# EasyEDA Pro project Pannel.eprj

# Schematic SCH

## Sheets
1 PWR: Board Name: Board1; Create Date: 2025-08-30; Page Name: PWR; Project Name: Pannel; Schematic Name: SCH; Update Date: 2025-08-30; Company: 嘉立创EDA; Page Size: A4; Version: V1.0
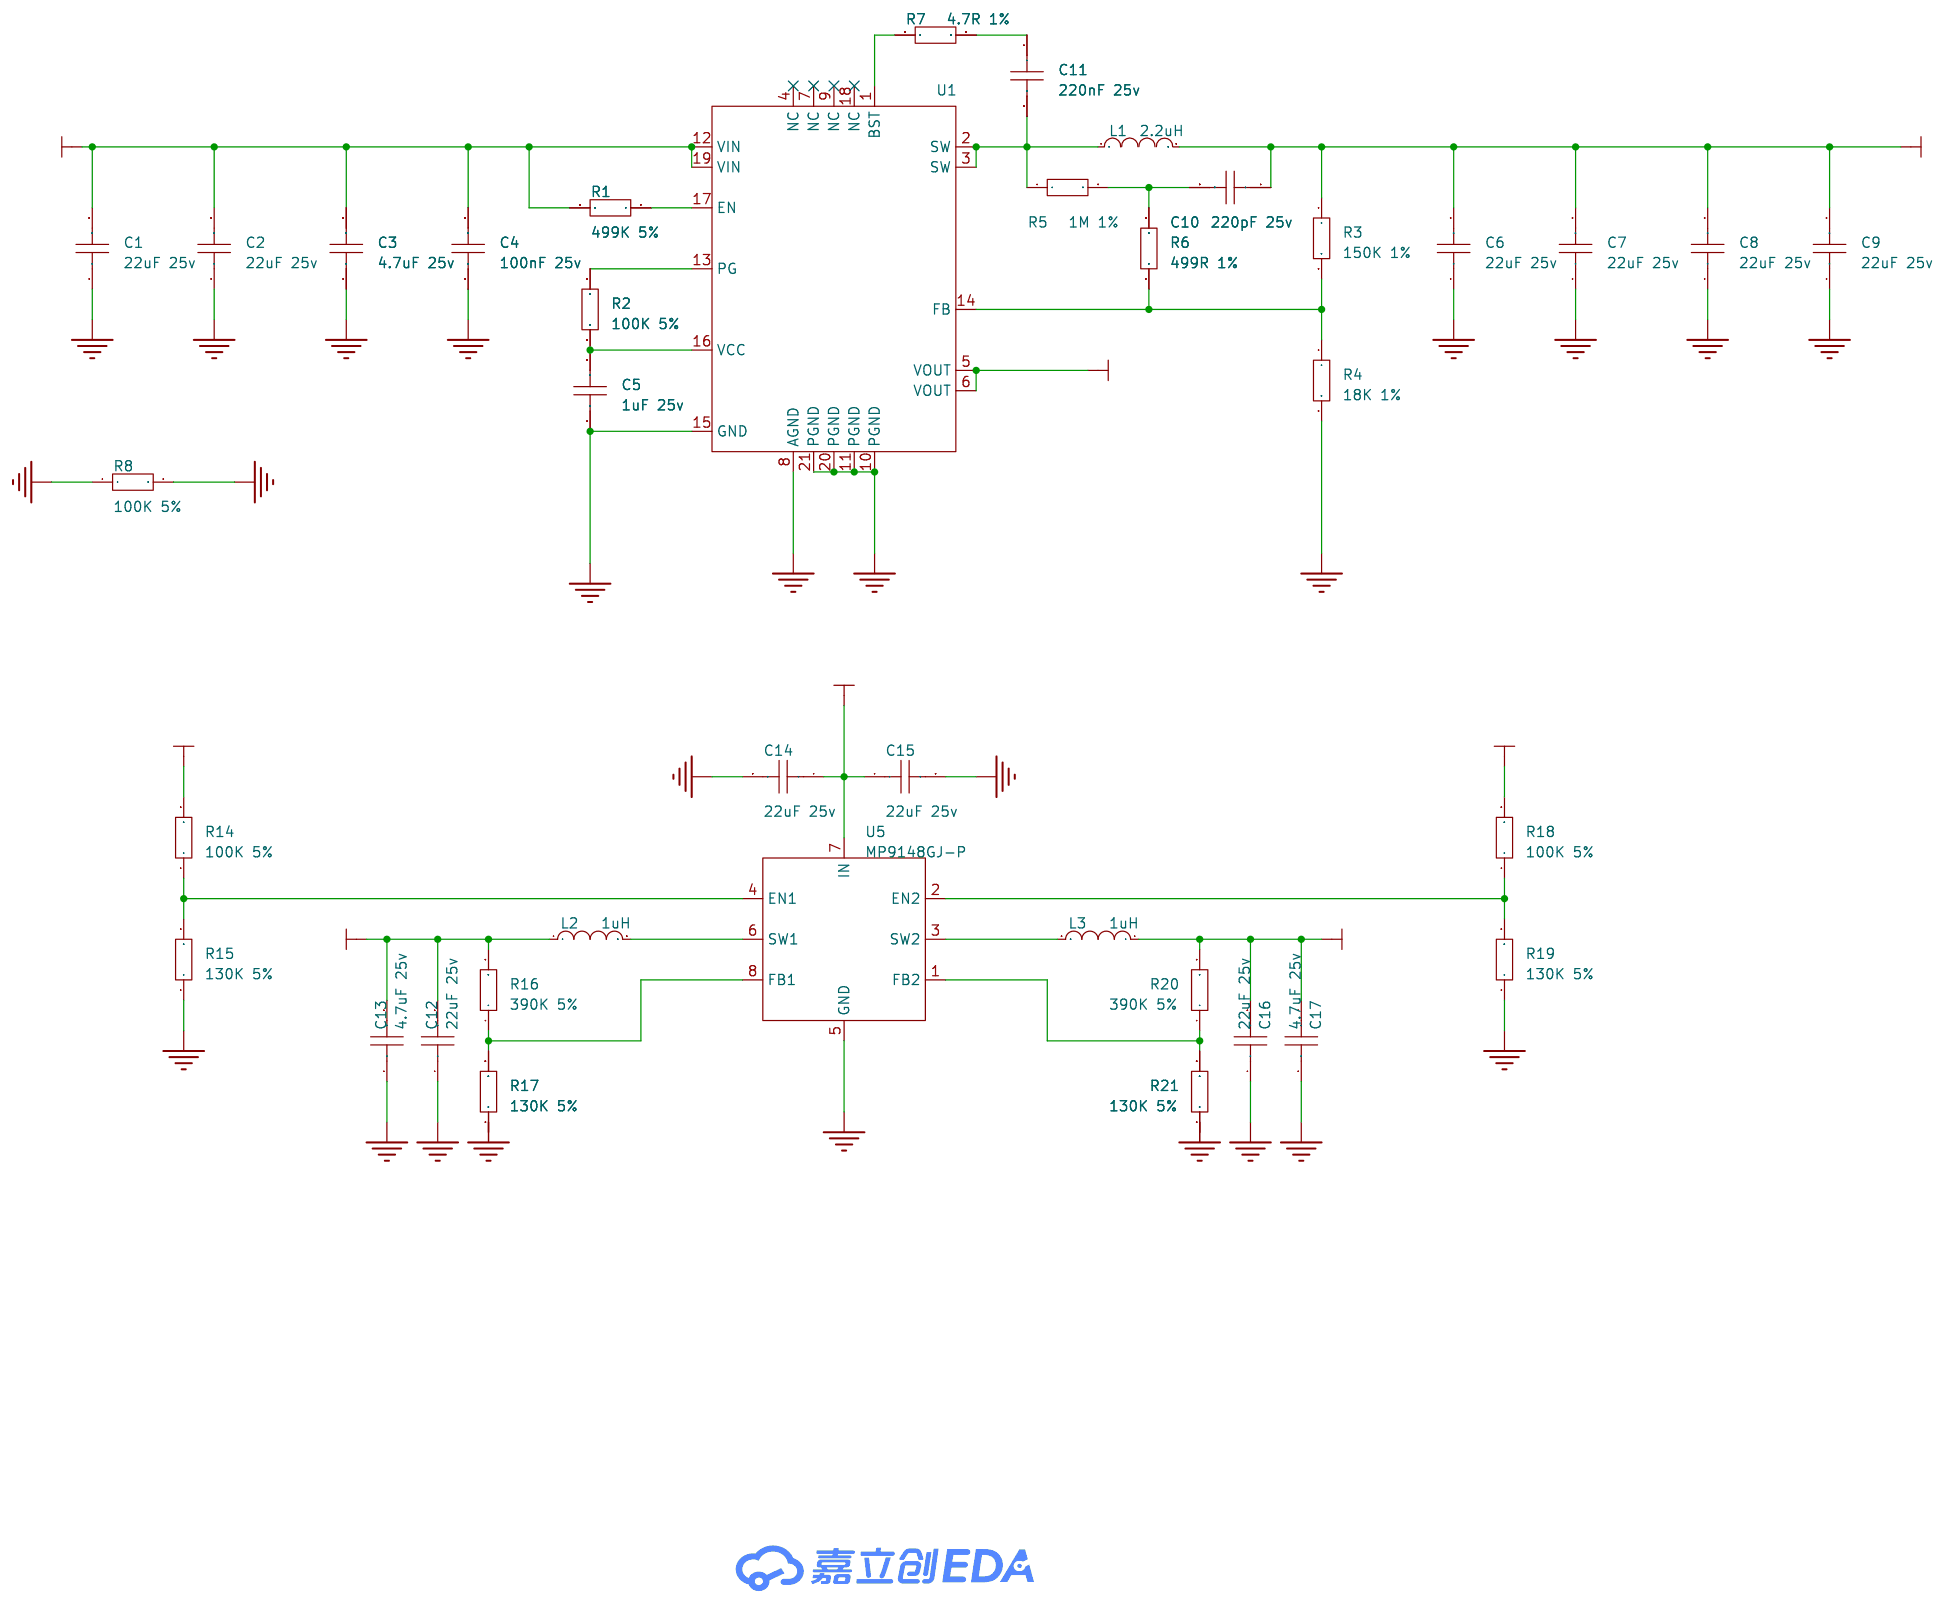
[diagram p0: PWR]
2 Connector: Page Name: Connector
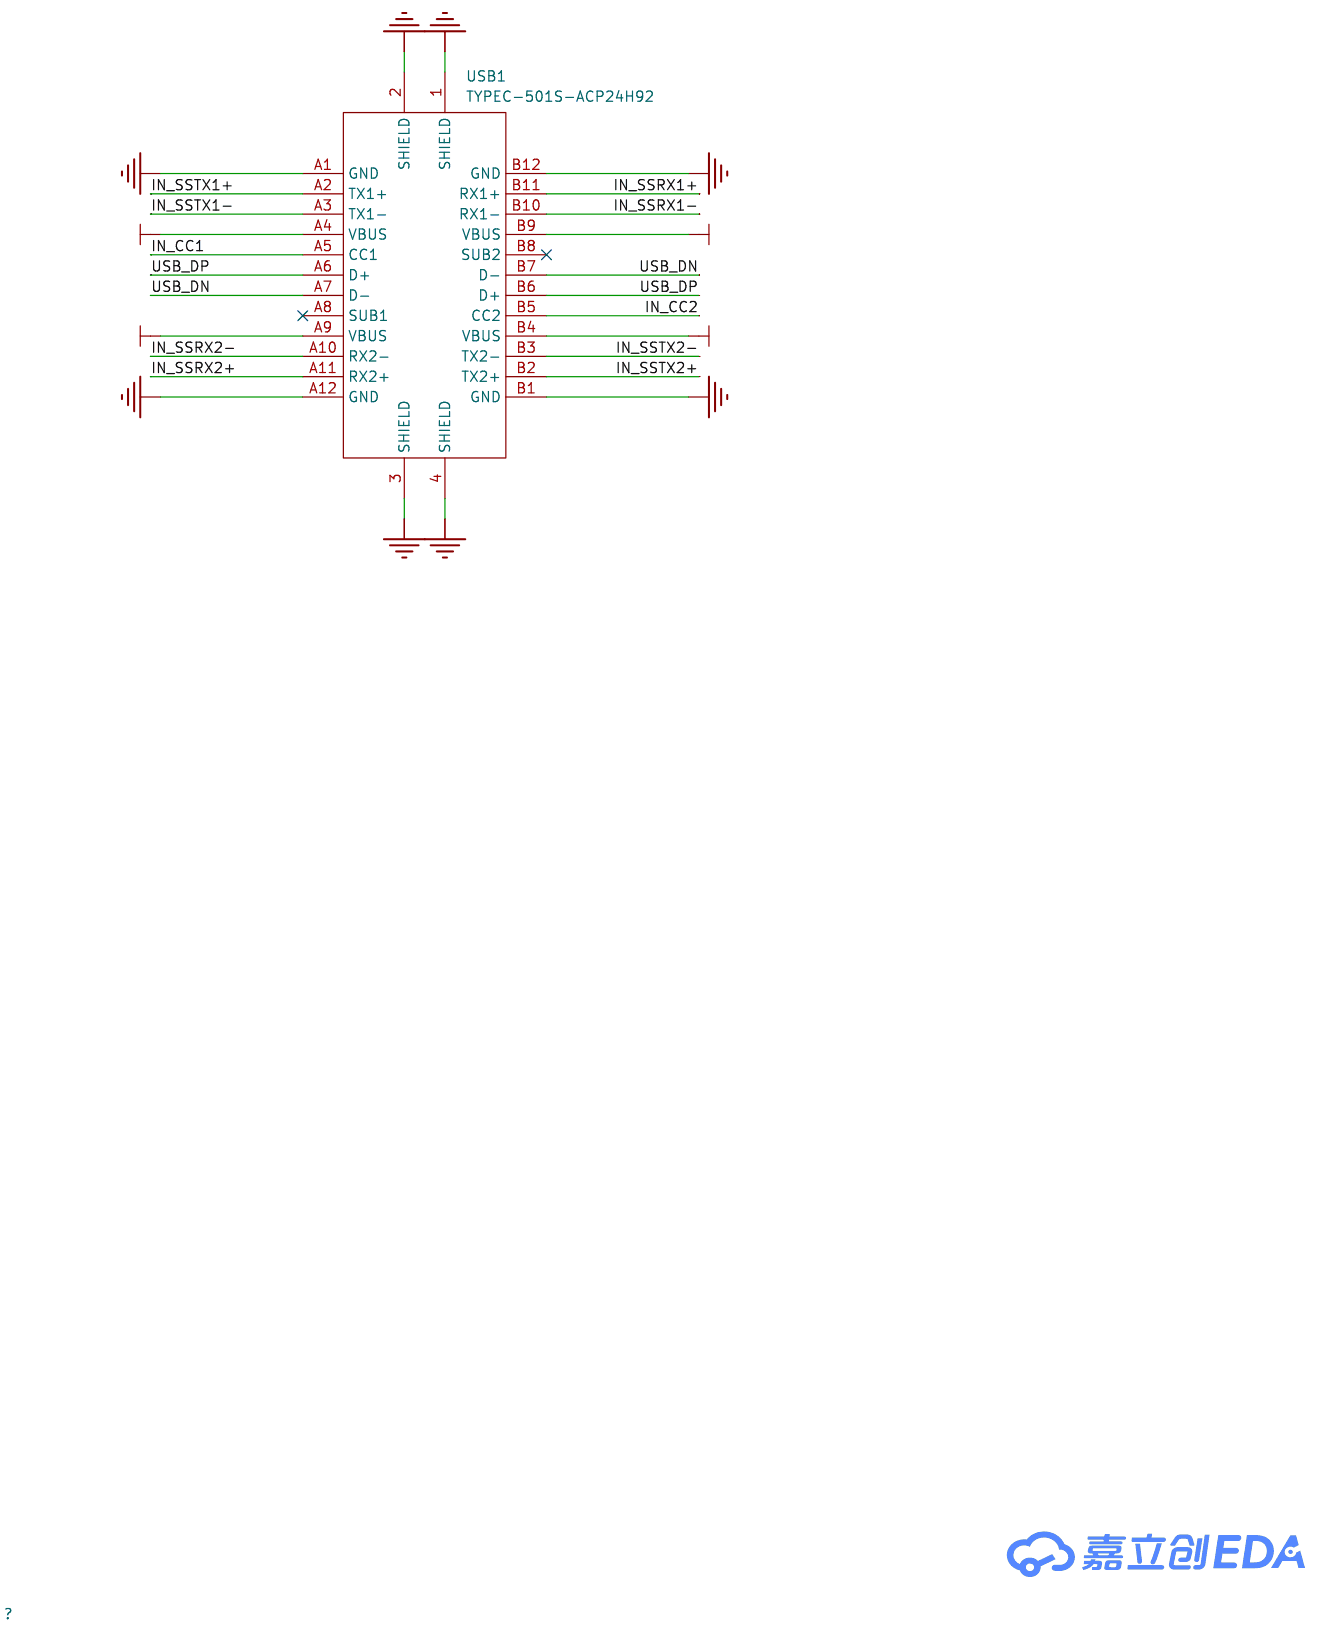
[diagram p1: Connector]
3 Core: Page Name: Core
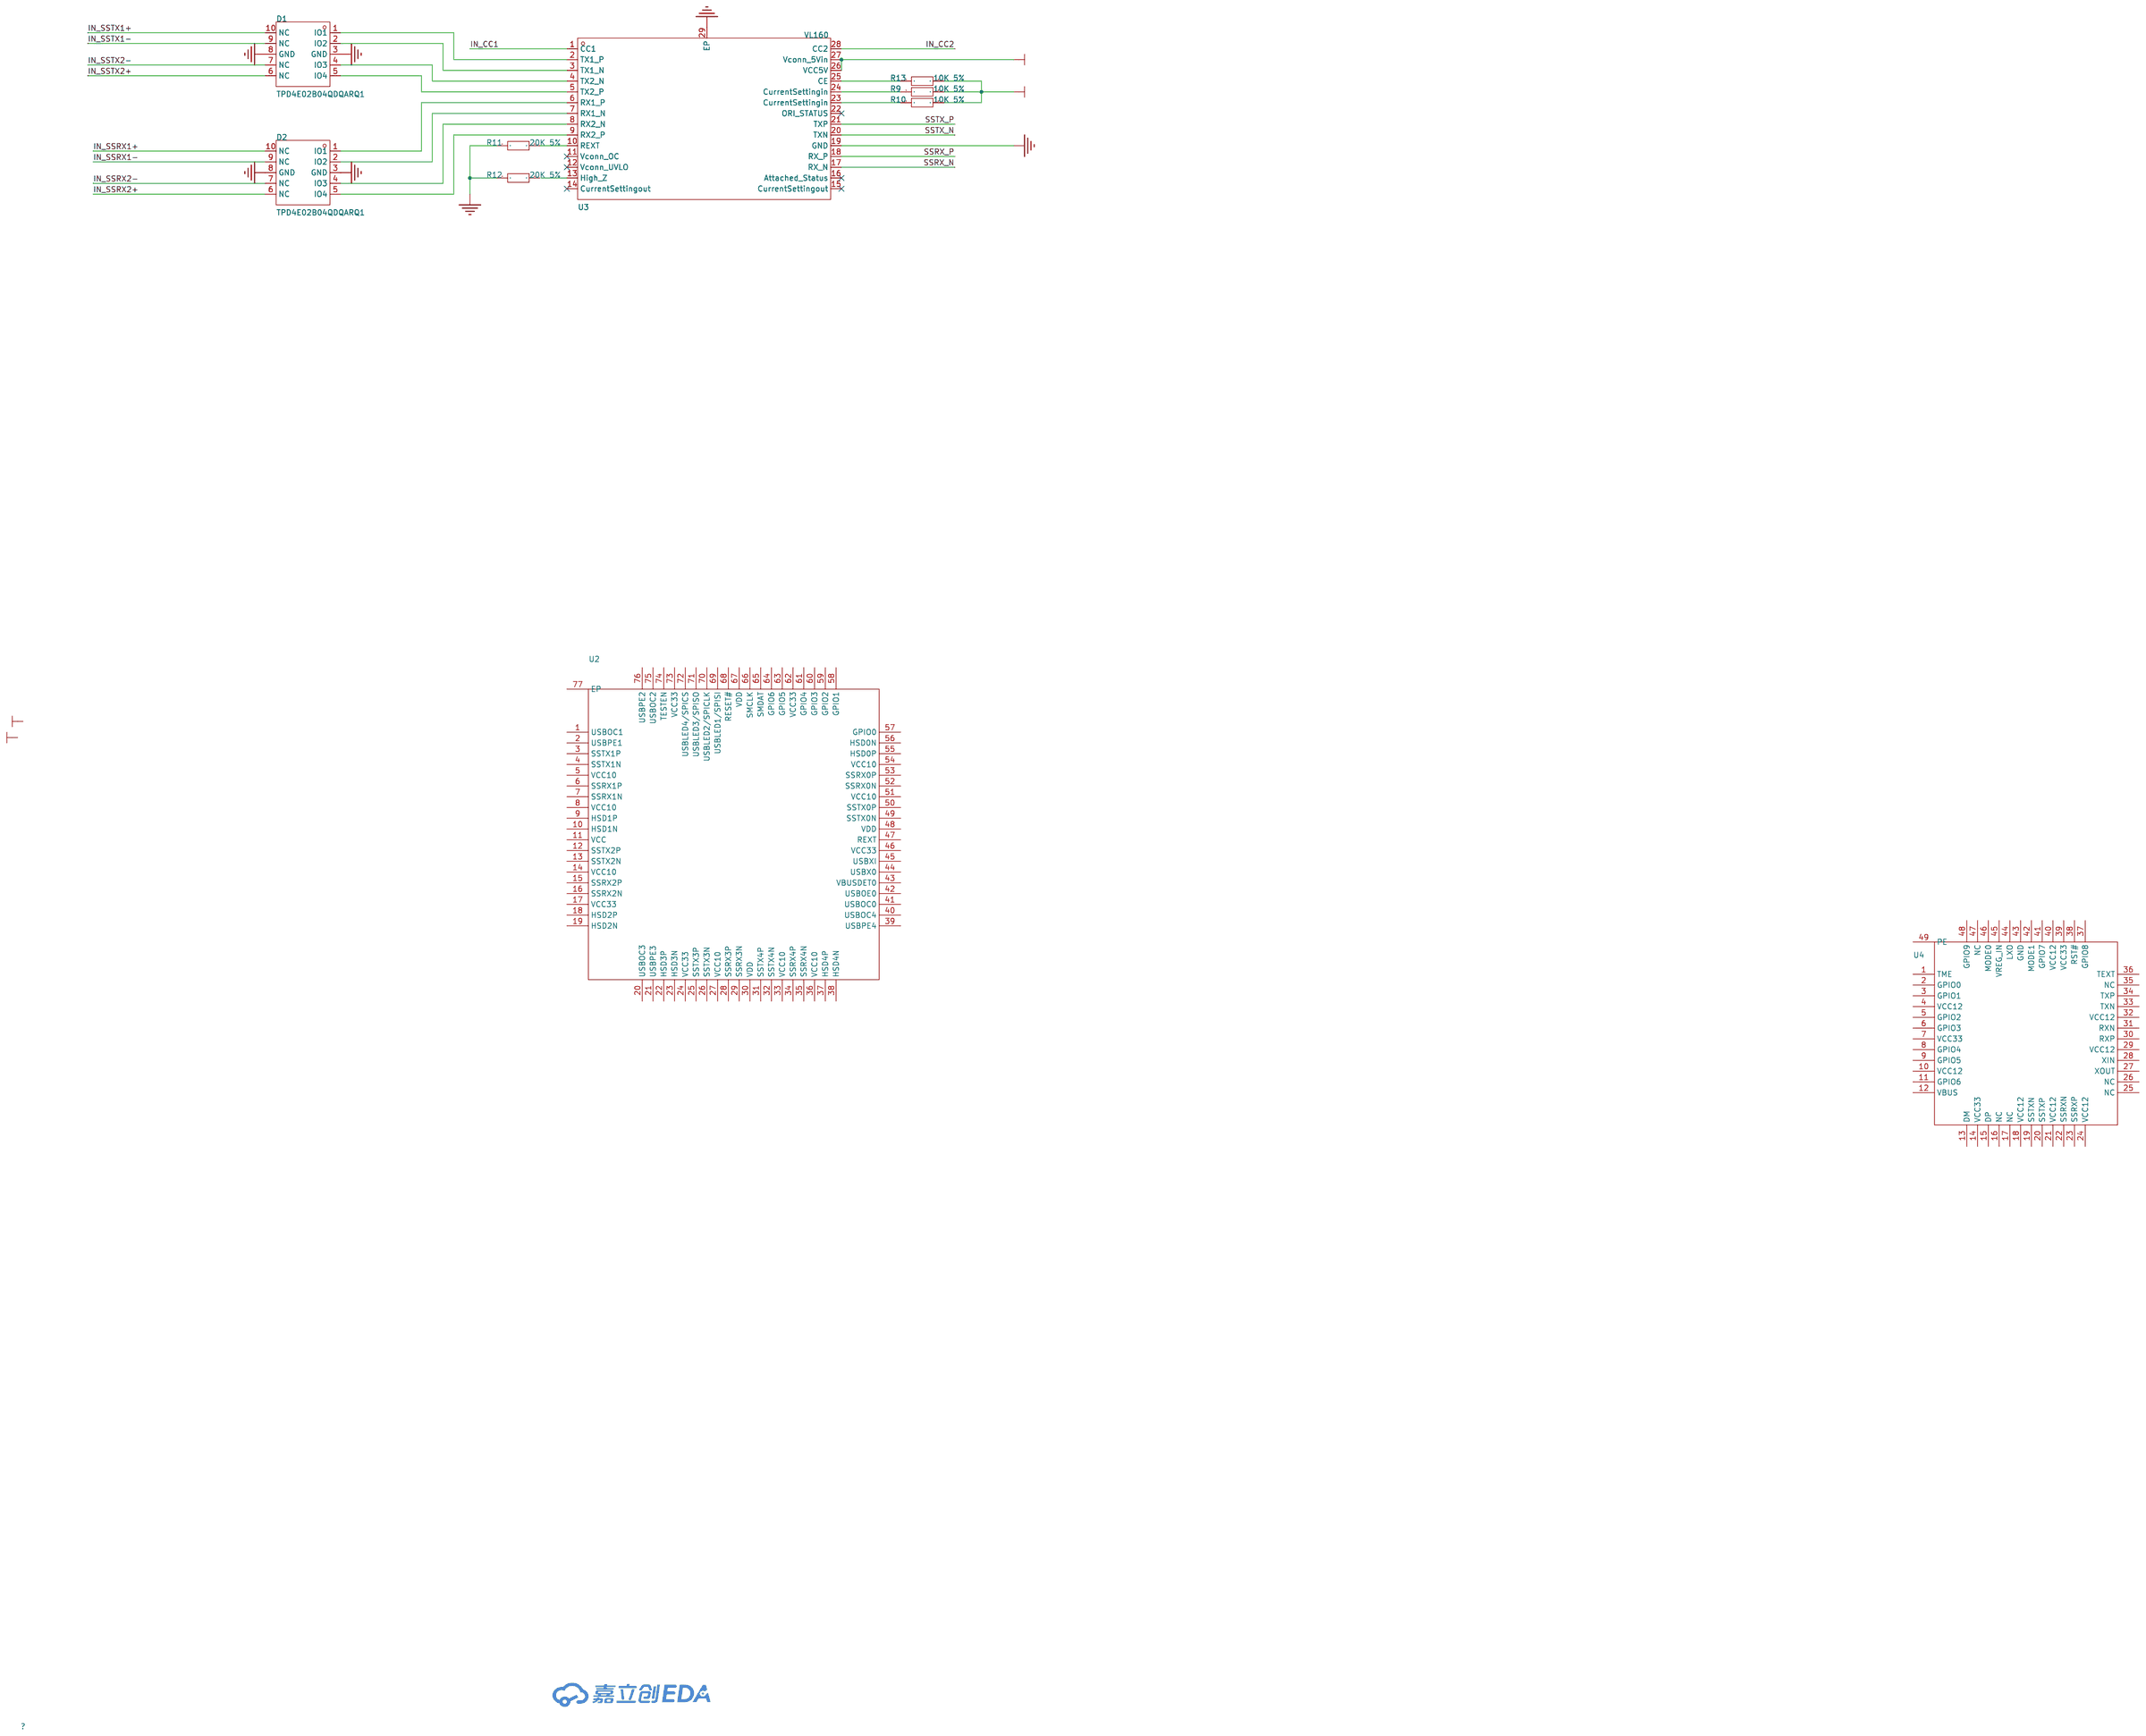
[diagram p2: Core]

## Parts
sheet Connector
USB1  TYPEC-501S-ACP24H92  [USB-C-SMD_TYPEC-501S-ACP24H92]
sheet Core
D1  TPD4E02B04QDQARQ1  [USON-10_L2.5-W1.0-P0.50-BL]
D2  TPD4E02B04QDQARQ1  [USON-10_L2.5-W1.0-P0.50-BL]
R9  10K 5%  [R0402]
R10  10K 5%  [R0402]
R11  20K 5%  [R0402]
R12  20K 5%  [R0402]
R13  10K 5%  [R0402]
U2  -  [QFN-76_L9.0-W9.0-P0.40-TL-EP]
U3  VL160  [MQFN-28_L4.5-W3.5-P0.40-BL-EP]
U4  -  [QFN-48_L5.0-W5.0-P0.35-BL-EP3.7-1]
sheet PWR
C1  22uF 25v  [C0805]
C2  22uF 25v  [C0805]
C3  4.7uF 25v  [C0805]
C4  100nF 25v  [C0805]
C5  1uF 25v  [R0402]
C6  22uF 25v  [C0805]
C7  22uF 25v  [C0805]
C8  22uF 25v  [C0805]
C9  22uF 25v  [C0805]
C10  220pF 25v  [R0402]
C11  220nF 25v  [R0402]
C12  22uF 25v  [C0805]
C13  4.7uF 25v  [C0805]
C14  22uF 25v  [C0805]
C15  22uF 25v  [C0805]
C16  22uF 25v  [C0805]
C17  4.7uF 25v  [C0805]
L1  2.2uH  [IND-SMD_L7.4-W7.4-P6.40]
L2  1uH  [IND-SMD_L4.5-W4.1_YXMAA0402]
L3  1uH  [IND-SMD_L4.5-W4.1_YXMAA0402]
R1  499K 5%  [R0402]
R2  100K 5%  [R0402]
R3  150K 1%  [R0402]
R4  18K 1%  [R0402]
R5  1M 1%  [R0402]
R6  499R 1%  [R0402]
R7  4.7R 1%  [R0402]
R8  100K 5%  [R0402]
R14  100K 5%  [R0402]
R15  130K 5%  [R0402]
R16  390K 5%  [R0402]
R17  130K 5%  [R0402]
R18  100K 5%  [R0402]
R19  130K 5%  [R0402]
R20  390K 5%  [R0402]
R21  130K 5%  [R0402]
U1  -  [QFN-21_L4.0-W3.0-P0.40-BL_NB675GL-Z]
U5  MP9148GJ-P  [TSOT-23-8_L2.9-W1.6-P0.65-LS2.8-BR]

## Library data of the parts
USB1 = TYPEC-501S-ACP24H92: LCSC Part Name: Type-C 母 立贴; Supplier Part: C2840394; Manufacturer: XUNPU(讯普); Supplier Footprint: SMD; Datasheet: https://atta.szlcsc.com/upload/public/pdf/source/20210615/C2840394_E52D2D2B2181E4EA8C5C0C9961EFC3F0.pdf; Supplier: LCSC; Connector Type: Type-C; Standard: USB 3.1; Gender: 母; Number of Ports: 1; Number of Contacts: 24P; Mounting Style: 立贴; Current Rating - Power (Max): 5A; Operating Temperature Range: -45℃~+85℃; Soldering Temperature(Max): 260℃
D1 D2 = TPD4E02B04QDQARQ1: Supplier Part: C1973193; Manufacturer: TI(德州仪器); Supplier Footprint: USON-10(1x2.5); JLCPCB Part Class: 扩展库; Datasheet: https://www.ti.com/cn/lit/gpn/tpd4e02b04-q1; Supplier: LCSC; Reverse Stand-Off Voltage (Vrwm): 3.6V; Maximum Clamping Voltage: 8.8V; Peak Pulse Current (Ipp)@10/1000us: 2A@(8/20us); Peak Pulse Power Dissipation (Ppp)@10/1000us: 17W; Breakdown Voltage: 5.5V; Operating Temperature: -40℃~+125℃@(Ta); Type: ESD
R1-R21 = Res_0603: Supplier Footprint: 0603
U2 = VL822
U3 = VL160: Supplier Part: C2841472; Supplier Footprint: MQFN-28-EP(3.5x4.5); JLCPCB Part Class: 扩展库; Datasheet: https://atta.szlcsc.com/upload/public/pdf/source/20210707/C2841472_23203D4DC0B460F77735B81667EEBB6C.pdf; Supplier: LCSC
U4 = JMS578
C1-C17 = CAP_0603: Supplier Footprint: 0603
L1 = L_0603: Supplier Footprint: L0603
L2 L3 = MDA4020-3R3M: LCSC Part Name: 3.3uH ±20% 3.1A; Supplier Part: C2847470; Manufacturer: KOHERelec(科或); Supplier Footprint: SMD,4.1x4.5mm; JLCPCB Part Class: 扩展库; Datasheet: https://atta.szlcsc.com/upload/public/pdf/source/20230823/B510F4699C7D5A6DE1AF0A7615377161.pdf; Supplier: LCSC; Tolerance: ±20%; Current - Saturation (Isat): 3.1A; DC Resistance(DCR): 65mΩ
U1 = MP8757
U5 = MP9148GJ-P: 功能类型:降压型;输出类型:可调;工作电压:2.7V~6V;输出电压:608mV~5.5V;输出电流:1A;; Supplier Part: C6306230; Supplier Footprint: TSOT-23-8; JLCPCB Part Class: 扩展库; Datasheet: https://atta.szlcsc.com/upload/public/pdf/source/20241101/11F627CB7148B9D13C02E5BCF276FDF2.pdf; Supplier: LCSC; Function: 降压型; Output Type: 可调; Voltage - Supply: 2.7V~6V; Output Voltage: 608mV~5.5V; Output Current: 1A; Frequency - Switching: 1MHz; Operating Temperature: -40℃~+125℃@(TJ); Synchronous Rectifier: 是; Number of Outputs: 2; Topology: 降压式; Switch tube (built-in/external): 内置

## Nets
GND: C1.1 C2.1 C3.1 C4.1 C5.1 C6.1 C7.1 C8.1 C9.1 C12.1 C13.1 C14.2 C15.2 C16.1 C17.1 D1.3(GND) D1.8(GND) D2.3(GND) D2.8(GND) R4.2 R8.1 R11.1 R12.1 R15.1 R17.1 R19.1 R21.1 U1.8(AGND) U1.15(GND) U3.19(GND) U3.29(EP) U5.5(GND) USB1.1(SHIELD) USB1.2(SHIELD) USB1.3(SHIELD) USB1.4(SHIELD) USB1.A1(GND) USB1.A12(GND) USB1.B1(GND) USB1.B12(GND)
PGND: R8.2 U1.10(PGND) U1.11(PGND) U1.20(PGND) U1.21(PGND)
VBUS: C14.1 C15.1 R9.2 R10.2 R13.2 R14.2 R18.2 U3.26(VCC5V) U3.27(Vconn_5Vin) U5.7(IN) USB1.A4(VBUS) USB1.A9(VBUS) USB1.B4(VBUS) USB1.B9(VBUS)
VCC1V0: C12.2 C13.2 L2.1 R16.2
VCC3V3: C16.2 C17.2 L3.1 R20.2
VCC5V: C6.2 C7.2 C8.2 C9.2 C10.1 L1.2 R3.1 U1.5(VOUT) U1.6(VOUT)
VCC12V: C1.2 C2.2 C3.2 C4.2 R1.2 U1.12(VIN) U1.19(VIN)
IN_CC1: U3.1(CC1) USB1.A5(CC1)
IN_CC2: U3.28(CC2) USB1.B5(CC2)
IN_SSRX1+: D2.10(NC) USB1.B11(RX1+)
IN_SSRX1-: D2.9(NC) USB1.B10(RX1-)
IN_SSRX2+: D2.6(NC) USB1.A11(RX2+)
IN_SSRX2-: D2.7(NC) USB1.A10(RX2-)
IN_SSTX1+: D1.10(NC) USB1.A2(TX1+)
IN_SSTX1-: D1.9(NC) USB1.A3(TX1-)
IN_SSTX2+: D1.6(NC) USB1.B2(TX2+)
IN_SSTX2-: D1.7(NC) USB1.B3(TX2-)
SSRX_N: U3.17(RX_N)
SSRX_P: U3.18(RX_P)
SSTX_N: U3.20(TXN)
SSTX_P: U3.21(TXP)
USB_DN: USB1.A7(D-) USB1.B7(D-)
USB_DP: USB1.A6(D+) USB1.B6(D+)
$1N801: R1.1 U1.17(EN)
$1N1167: C5.2 R2.2 U1.16(VCC)
$1N1195: R2.1 U1.13(PG)
$1N1300: C11.2 L1.1 R5.1 U1.2(SW) U1.3(SW)
$1N1549: R3.2 R4.1 R6.1 U1.14(FB)
$1N1642: C10.2 R5.2 R6.2
$1N2486: C11.1 R7.2
$1N2490: R7.1 U1.1(BST)
$1N3667: R14.1 R15.2 U5.4(EN1)
$1N3726: L2.2 U5.6(SW1)
$1N3958: R16.1 R17.2 U5.8(FB1)
$1N4382: R20.1 R21.2 U5.1(FB2)
$1N4388: R18.1 R19.2 U5.2(EN2)
$1N4404: L3.2 U5.3(SW2)
$3N1323: D1.1(IO1) U3.2(TX1_P)
$3N1332: D1.2(IO2) U3.3(TX1_N)
$3N1342: D1.4(IO3) U3.4(TX2_N)
$3N1352: D1.5(IO4) U3.5(TX2_P)
$3N1362: D2.5(IO4) U3.9(RX2_P)
$3N1377: D2.4(IO3) U3.8(RX2_N)
$3N1386: D2.2(IO2) U3.7(RX1_N)
$3N1396: D2.1(IO1) U3.6(RX1_P)
$3N1544: R9.1 U3.24(CurrentSettingin)
$3N1572: R10.1 U3.23(CurrentSettingin)
$3N1628: R11.2 U3.10(REXT)
$3N1736: R13.1 U3.25(CE)

Not connected (* = marked no-connect by the designer): R12 2; U1 4(NC)* 7(NC)* 9(NC)* 18(NC)*; U2 1(USBOC1) 2(USBPE1) 3(SSTX1P) 4(SSTX1N) 5(VCC10) 6(SSRX1P) 7(SSRX1N) 8(VCC10) 9(HSD1P) 10(HSD1N) 11(VCC) 12(SSTX2P) 13(SSTX2N) 14(VCC10) 15(SSRX2P) 16(SSRX2N) 17(VCC33) 18(HSD2P) 19(HSD2N) 20(USBOC3) 21(USBPE3) 22(HSD3P) 23(HSD3N) 24(VCC33) 25(SSTX3P) 26(SSTX3N) 27(VCC10) 28(SSRX3P) 29(SSRX3N) 30(VDD) 31(SSTX4P) 32(SSTX4N) 33(VCC10) 34(SSRX4P) 35(SSRX4N) 36(VCC10) 37(HSD4P) 38(HSD4N) 39(USBPE4) 40(USBOC4) 41(USBOC0) 42(USBOE0) 43(VBUSDET0) 44(USBX0) 45(USBXI) 46(VCC33) 47(REXT) 48(VDD) 49(SSTX0N) 50(SSTX0P) 51(VCC10) 52(SSRX0N) 53(SSRX0P) 54(VCC10) 55(HSD0P) 56(HSD0N) 57(GPIO0) 58(GPIO1) 59(GPIO2) 60(GPIO3) 61(GPIO4) 62(VCC33) 63(GPIO5) 64(GPIO6) 65(SMDAT) 66(SMCLK) 67(VDD) 68(RESET#) 69(USBLED1/SPISI) 70(USBLED2/SPICLK) 71(USBLED3/SPISO) 72(USBLED4/SPICS) 73(VCC33) 74(TESTEN) 75(USBOC2) 76(USBPE2) 77(EP); U3 11(Vconn_OC)* 12(Vconn_UVLO)* 13(High_Z) 14(CurrentSettingout)* 15(CurrentSettingout)* 16(Attached_Status)* 22(ORI_STATUS)*; U4 1(TME) 2(GPIO0) 3(GPIO1) 4(VCC12) 5(GPIO2) 6(GPIO3) 7(VCC33) 8(GPIO4) 9(GPIO5) 10(VCC12) 11(GPIO6) 12(VBUS) 13(DM) 14(VCC33) 15(DP) 16(NC) 17(NC) 18(VCC12) 19(SSTXN) 20(SSTXP) 21(VCC12) 22(SSRXN) 23(SSRXP) 24(VCC12) 25(NC) 26(NC) 27(XOUT) 28(XIN) 29(VCC12) 30(RXP) 31(RXN) 32(VCC12) 33(TXN) 34(TXP) 35(NC) 36(TEXT) 37(GPIO8) 38(RST#) 39(VCC33) 40(VCC12) 41(GPIO7) 42(MODE1) 43(GND) 44(LXO) 45(VREG_IN) 46(MODE0) 47(NC) 48(GPIO9) 49(PE); USB1 A8(SUB1)* B8(SUB2)*

# Board PCB1
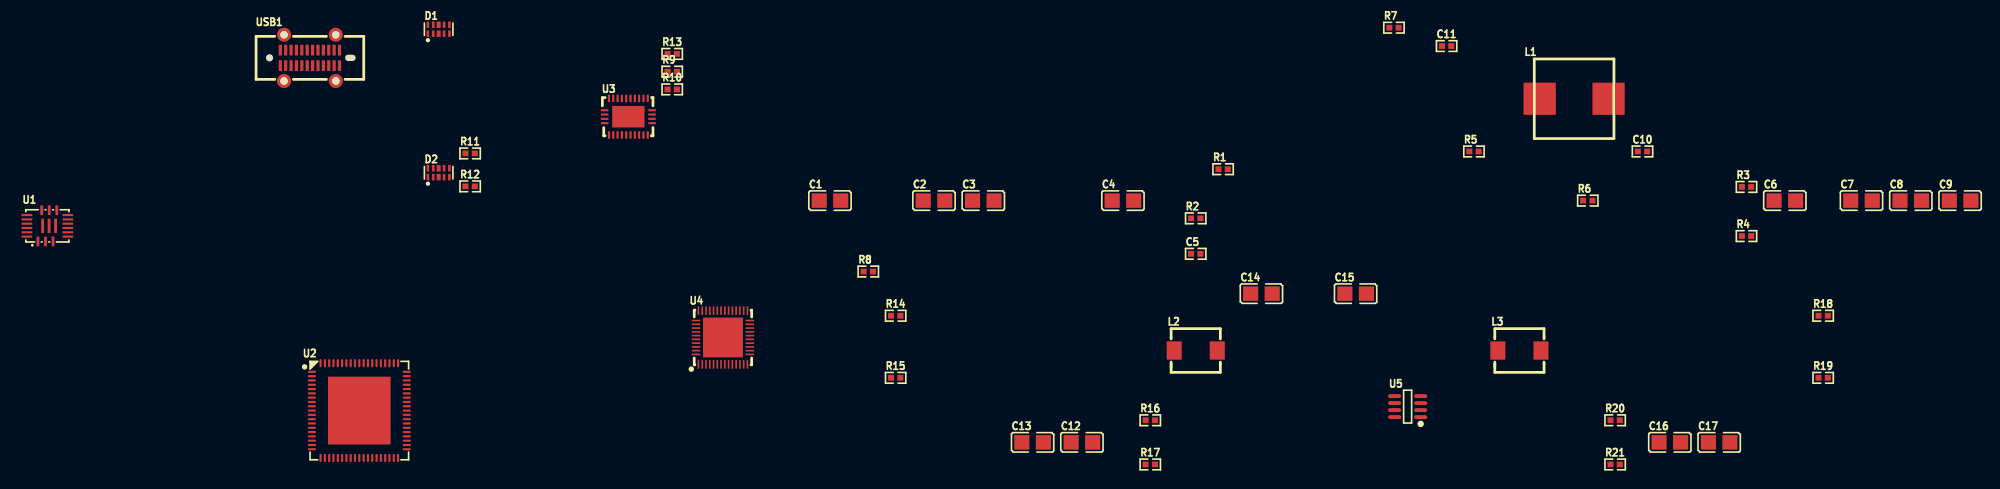
[diagram p3: board, top side]
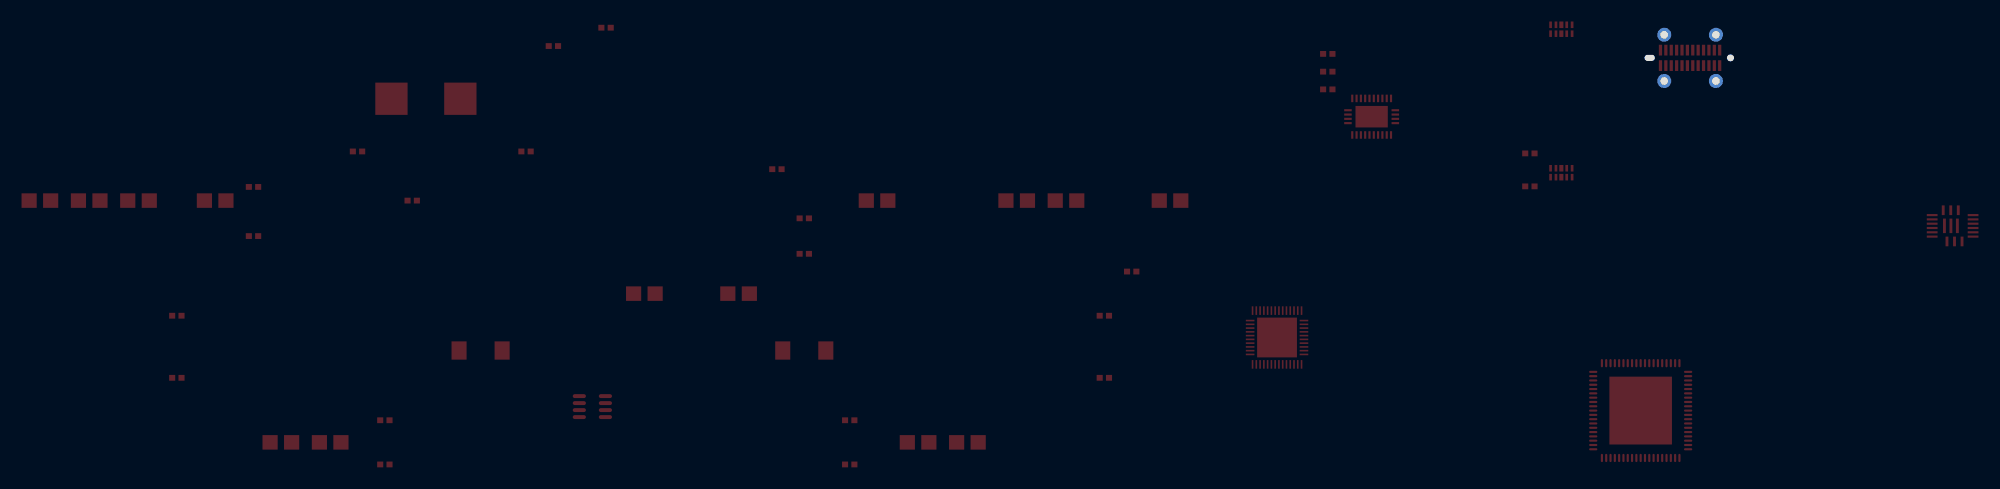
[diagram p4: board, bottom side, seen from below]

Outline 8.32 x 0.65 mm; copper layers: Top Layer, Bottom Layer. Coordinates in mm from the lower left corner of the outline.
Stack: Top Layer 0.035mm / Dielectric1 1.51mm FR4 er 4.5 / Bottom Layer 0.035mm

## Design rules (mm)
template: JLCPCB Capability(Two Layers Board)
spacing copperThickness1oz (default): track to track 0.102, other pairs 0.152 to 0.3
spacing copperThickness2oz: track to track 0.203, other pairs 0.152 to 0.3
track width copperThickness1oz (default): min 0.127, default 0.254, max 2.54
track width copperThickness2oz: min 0.203, default 0.254, max 2.54
differential pair differentialPair (default): width min 0.127, default 0.254, max 2.54; gap min 0.152, default 0.152
via viaSize (default): diameter min 0.5, default 0.61, max 10; hole min 0.3, default 0.305, max 6.3

## Placement (name value [footprint] x y rotation side)
C1  22uF 25v  [C0805]  52.38 -12.94 0 top
C2  22uF 25v  [C0805]  62.04 -12.94 0 top
C3  4.7uF 25v  [C0805]  66.62 -12.94 0 top
C4  100nF 25v  [C0805]  79.59 -12.94 0 top
C5  1uF 25v  [R0402]  86.35 -17.89 0 top
C6  22uF 25v  [C0805]  141.06 -12.94 0 top
C7  22uF 25v  [C0805]  148.19 -12.94 0 top
C8  22uF 25v  [C0805]  152.76 -12.94 0 top
C9  22uF 25v  [C0805]  157.34 -12.94 0 top
C10  220pF 25v  [R0402]  127.84 -8.38 0 top
C11  220nF 25v  [R0402]  109.65 1.43 0 top
C12  22uF 25v  [C0805]  75.78 -35.43 0 top
C13  4.7uF 25v  [C0805]  71.2 -35.43 0 top
C14  22uF 25v  [C0805]  92.45 -21.6 0 top
C15  22uF 25v  [C0805]  101.2 -21.6 0 top
C16  22uF 25v  [C0805]  130.38 -35.43 0 top
C17  4.7uF 25v  [C0805]  134.96 -35.43 0 top
D1  TPD4E02B04QDQARQ1  [USON-10_L2.5-W1.0-P0.50-BL]  16.03 2.99 0 top
D2  TPD4E02B04QDQARQ1  [USON-10_L2.5-W1.0-P0.50-BL]  16.03 -10.35 0 top
L1  2.2uH  [IND-SMD_L7.4-W7.4-P6.40]  121.49 -3.47 0 top
L2  1uH  [IND-SMD_L4.5-W4.1_YXMAA0402]  86.35 -26.89 0 top
L3  1uH  [IND-SMD_L4.5-W4.1_YXMAA0402]  116.41 -26.89 0 top
R1  499K 5%  [R0402]  88.89 -10.03 0 top
R2  100K 5%  [R0402]  86.35 -14.59 0 top
R3  150K 1%  [R0402]  137.5 -11.67 0 top
R4  18K 1%  [R0402]  137.5 -16.24 0 top
R5  1M 1%  [R0402]  112.19 -8.38 0 top
R6  499R 1%  [R0402]  122.76 -12.94 0 top
R7  4.7R 1%  [R0402]  104.76 3.13 0 top
R8  100K 5%  [R0402]  55.94 -19.54 0 top
R9  10K 5%  [R0402]  37.73 -0.95 0 top
R10  10K 5%  [R0402]  37.73 -2.6 0 top
R11  20K 5%  [R0402]  18.96 -8.56 0 top
R12  20K 5%  [R0402]  18.96 -11.62 0 top
R13  10K 5%  [R0402]  37.73 0.7 0 top
R14  100K 5%  [R0402]  58.48 -23.65 0 top
R15  130K 5%  [R0402]  58.48 -29.43 0 top
R16  390K 5%  [R0402]  82.13 -33.37 0 top
R17  130K 5%  [R0402]  82.13 -37.48 0 top
R18  100K 5%  [R0402]  144.62 -23.65 0 top
R19  130K 5%  [R0402]  144.62 -29.43 0 top
R20  390K 5%  [R0402]  125.3 -33.37 0 top
R21  130K 5%  [R0402]  125.3 -37.48 0 top
U1  -  [QFN-21_L4.0-W3.0-P0.40-BL_NB675GL-Z]  -20.31 -15.29 0 top
U2  -  [QFN-76_L9.0-W9.0-P0.40-TL-EP]  8.67 -32.47 0 top
U3  VL160  [MQFN-28_L4.5-W3.5-P0.40-BL-EP]  33.65 -5.14 0 top
U4  -  [QFN-48_L5.0-W5.0-P0.35-BL-EP3.7-1]  42.44 -25.68 0 top
U5  MP9148GJ-P  [TSOT-23-8_L2.9-W1.6-P0.65-LS2.8-BR]  106.03 -32.1 0 top
USB1  TYPEC-501S-ACP24H92  [USB-C-SMD_TYPEC-501S-ACP24H92]  4.08 0.33 0 top

## Footprints (pads in the part's own frame, mm; a bottom-side part is the same pattern mirrored in y, then rotated)
C0805
  rect 1.41x1.35 smd: 1(-1,0) 2(1,0)
IND-SMD_L4.5-W4.1_YXMAA0402
  rect 1.4x1.7 smd: 1(-2,0) 2(2,0)
IND-SMD_L7.4-W7.4-P6.40
  rect 3x3 smd: 1(-3.2,0) 2(3.2,0)
MQFN-28_L4.5-W3.5-P0.40-BL-EP
  rect 0.2x0.7 smd: 1(-1.8,-1.7) 2(-1.4,-1.7) 3(-1,-1.7) 4(-0.6,-1.7) 5(-0.2,-1.7) 6(0.2,-1.7) 7(0.6,-1.7) 8(1,-1.7) 9(1.4,-1.7) 10(1.8,-1.7) 15(1.8,1.7) 16(1.4,1.7) 17(1,1.7) 18(0.6,1.7) 19(0.2,1.7) 20(-0.2,1.7) 21(-0.6,1.7) 22(-1,1.7) 23(-1.4,1.7) 24(-1.8,1.7)
  rect 0.7x0.2 smd: 11(2.2,-0.6) 12(2.2,-0.2) 13(2.2,0.2) 14(2.2,0.6) 25(-2.2,0.6) 26(-2.2,0.2) 27(-2.2,-0.2) 28(-2.2,-0.6)
  rect 3x2 smd: 29(0,0)
QFN-21_L4.0-W3.0-P0.40-BL_NB675GL-Z
  rect 0.267x0.901 smd: 1(-0.875,-1.451) 2(-0.175,-1.451) 3(0.525,-1.451) 10(0.875,1.451) 11(0.175,1.451) 12(-0.525,1.451)
  rect 1x0.2 smd: 4(1.9,-1) 5(1.9,-0.6) 6(1.9,-0.2) 7(1.9,0.2) 8(1.9,0.6) 9(1.9,1) 13(-1.9,1) 14(-1.9,0.6) 15(-1.9,0.2) 16(-1.9,-0.2) 17(-1.9,-0.6) 18(-1.9,-1)
  rect 0.267x1.35 smd: 19(-0.44,0) 20(0.16,0) 21(0.76,0)
QFN-48_L5.0-W5.0-P0.35-BL-EP3.7-1
  rect 0.15x0.8 smd: 1(-2.275,-2.5) 2(-1.925,-2.5) 3(-1.575,-2.5) 4(-1.225,-2.5) 5(-0.875,-2.5) 6(-0.525,-2.5) 7(-0.175,-2.5) 8(0.175,-2.5) 9(0.525,-2.5) 10(0.875,-2.5) 11(1.225,-2.5) 12(1.575,-2.5) 13(1.925,-2.5) 14(2.275,-2.5) 25(2.275,2.5) 26(1.925,2.5) 27(1.575,2.5) 28(1.225,2.5) 29(0.875,2.5) 30(0.525,2.5) 31(0.175,2.5) 32(-0.175,2.5) 33(-0.525,2.5) 34(-0.875,2.5) 35(-1.225,2.5) 36(-1.575,2.5) 37(-1.925,2.5) 38(-2.275,2.5)
  rect 0.8x0.15 smd: 15(2.5,-1.575) 16(2.5,-1.225) 17(2.5,-0.875) 18(2.5,-0.525) 19(2.5,-0.175) 20(2.5,0.175) 21(2.5,0.525) 22(2.5,0.875) 23(2.5,1.225) 24(2.5,1.575) 39(-2.5,1.575) 40(-2.5,1.225) 41(-2.5,0.875) 42(-2.5,0.525) 43(-2.5,0.175) 44(-2.5,-0.175) 45(-2.5,-0.525) 46(-2.5,-0.875) 47(-2.5,-1.225) 48(-2.5,-1.575)
  rect 3.7x3.7 smd: 49(0.001,0)
QFN-76_L9.0-W9.0-P0.40-TL-EP
  oval 0.765x0.2 smd: 1(-4.407,3.6) 2(-4.407,3.2) 3(-4.407,2.8) 4(-4.407,2.4) 5(-4.407,2) 6(-4.407,1.6) 7(-4.407,1.2) 8(-4.407,0.8) 9(-4.407,0.4) 10(-4.407,0) 11(-4.407,-0.4) 12(-4.407,-0.8) 13(-4.407,-1.2) 14(-4.407,-1.6) 15(-4.407,-2) 16(-4.407,-2.4) 17(-4.407,-2.8) 18(-4.407,-3.2) 19(-4.407,-3.6) 39(4.407,-3.6) 40(4.407,-3.2) 41(4.407,-2.8) 42(4.407,-2.4) 43(4.407,-2) 44(4.407,-1.6) 45(4.407,-1.2) 46(4.407,-0.8) 47(4.407,-0.4) 48(4.407,0) 49(4.407,0.4) 50(4.407,0.8) 51(4.407,1.2) 52(4.407,1.6) 53(4.407,2) 54(4.407,2.4) 55(4.407,2.8) 56(4.407,3.2) 57(4.407,3.6)
  oval 0.2x0.765 smd: 20(-3.6,-4.407) 21(-3.2,-4.407) 22(-2.8,-4.407) 23(-2.4,-4.407) 24(-2,-4.407) 25(-1.6,-4.407) 26(-1.2,-4.407) 27(-0.8,-4.407) 28(-0.4,-4.407) 29(0,-4.407) 30(0.4,-4.407) 31(0.8,-4.407) 32(1.2,-4.407) 33(1.6,-4.407) 34(2,-4.407) 35(2.4,-4.407) 36(2.8,-4.407) 37(3.2,-4.407) 38(3.6,-4.407) 58(3.6,4.407) 59(3.2,4.407) 60(2.8,4.407) 61(2.4,4.407) 62(2,4.407) 63(1.6,4.407) 64(1.2,4.407) 65(0.8,4.407) 66(0.4,4.407) 67(0,4.407) 68(-0.4,4.407) 69(-0.8,4.407) 70(-1.2,4.407) 71(-1.6,4.407) 72(-2,4.407) 73(-2.4,4.407) 74(-2.8,4.407) 75(-3.2,4.407) 76(-3.6,4.407)
  rect 5.81x6.31 smd: 77(0,0)
R0402
  rect 0.566x0.54 smd: 1(-0.433,0) 2(0.433,0)
TSOT-23-8_L2.9-W1.6-P0.65-LS2.8-BR
  oval 1.222x0.364 smd: 1(1.211,-0.975) 2(1.211,-0.325) 3(1.211,0.325) 4(1.211,0.975) 5(-1.211,0.975) 6(-1.211,0.325) 7(-1.211,-0.325) 8(-1.211,-0.975)
USB-C-SMD_TYPEC-501S-ACP24H92
  round 1.3 hole 0.7: 1(-2.4,-2.15) 2(2.4,-2.15) 3(2.4,2.15) 4(-2.4,2.15)
  rect 0.3x1 smd: A1(-2.75,0.72) A2(-2.25,0.72) A3(-1.75,0.72) A4(-1.25,0.72) A5(-0.75,0.72) A6(-0.25,0.72) A7(0.25,0.72) A8(0.75,0.72) A9(1.25,0.72) A10(1.75,0.72) A11(2.25,0.72) A12(2.75,0.72) B1(2.75,-0.72) B2(2.25,-0.72) B3(1.75,-0.72) B4(1.25,-0.72) B5(0.75,-0.72) B6(0.25,-0.72) B7(-0.25,-0.72) B8(-0.75,-0.72) B9(-1.25,-0.72) B10(-1.75,-0.72) B11(-2.25,-0.72) B12(-2.75,-0.72)
USON-10_L2.5-W1.0-P0.50-BL
  rect 0.25x0.609 smd: 1(-1,-0.414) 2(-0.5,-0.414) 4(0.5,-0.414) 5(1,-0.414) 6(1,0.414) 7(0.5,0.414) 9(-0.5,0.414) 10(-1,0.414)
  rect 0.38x0.609 smd: 3(0,-0.414) 8(0,0.414)

## Nets
As in the schematic.

Pads without a net: R12 2; U1 4 7 9 18; U2 1 2 3 4 5 6 7 8 9 10 11 12 13 14 15 16 17 18 19 20 21 22 23 24 25 26 27 28 29 30 31 32 33 34 35 36 37 38 39 40 41 42 43 44 45 46 47 48 49 50 51 52 53 54 55 56 57 58 59 60 61 62 63 64 65 66 67 68 69 70 71 72 73 74 75 76 77; U3 11 12 14 15 16 22; U4 1 2 3 4 5 6 7 8 9 10 11 12 13 14 15 16 17 18 19 20 21 22 23 24 25 26 27 28 29 30 31 32 33 34 35 36 37 38 39 40 41 42 43 44 45 46 47 48 49; USB1 A8 B8
